# Altium project Power_Embedded_Board.PrjPcb
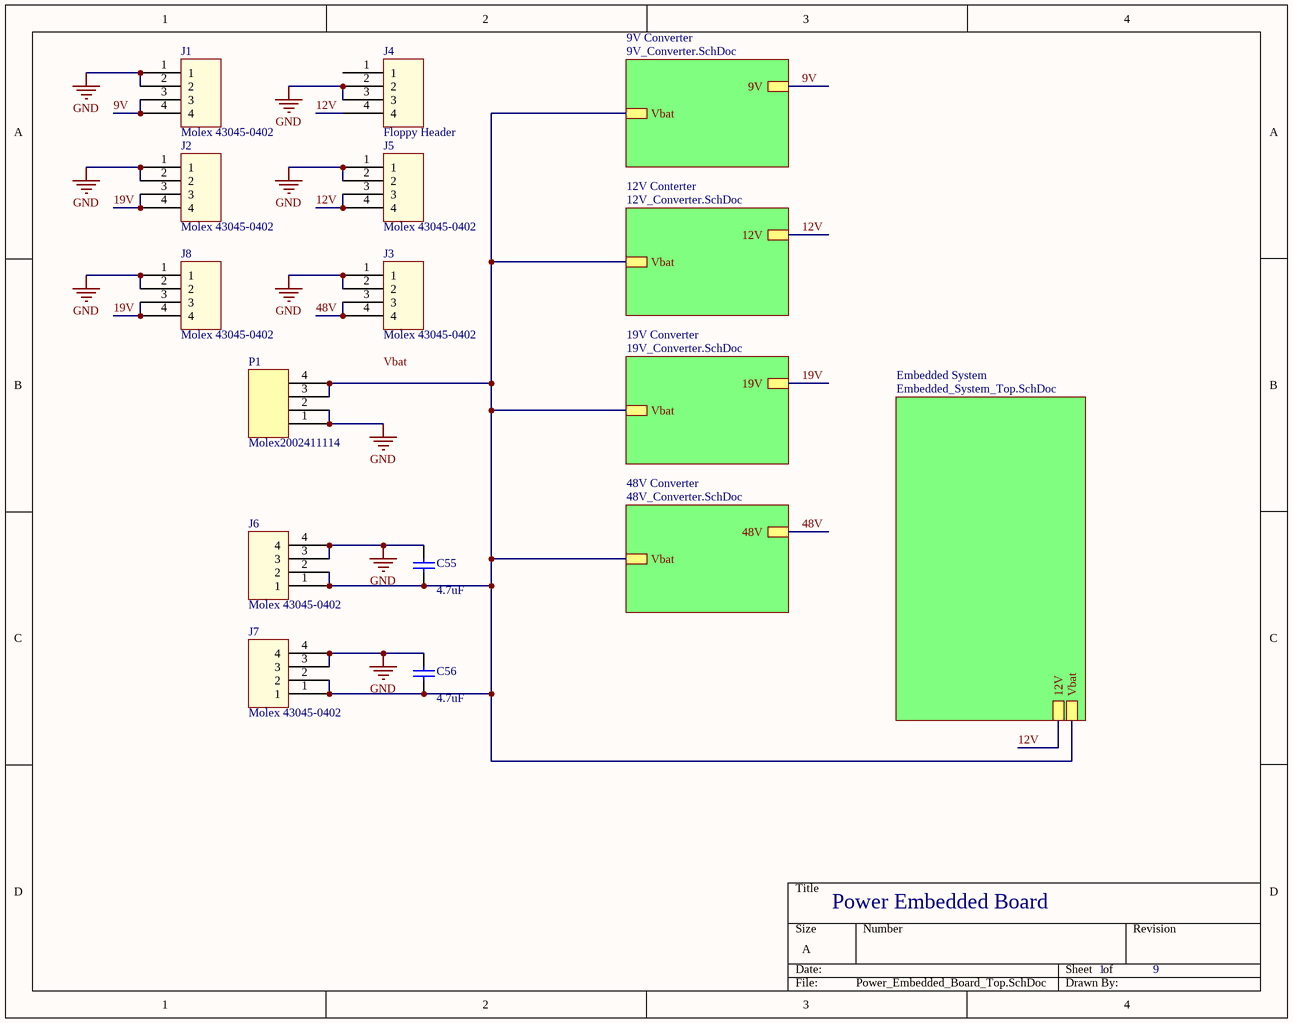
[diagram p0: Power_Embedded_Board_Top.SchDoc]
8 sheets, 160 parts. Net scope: hierarchical (ports join the sheet entries above them; power ports are global).
Board file: Power_Embedded_Board.PcbDoc
Sheets:
  Power_Embedded_Board_Top.SchDoc
    9V Converter = 9V_Converter.SchDoc
    12V Conterter = 12V_Converter.SchDoc
    19V Converter = 19V_Converter.SchDoc
    48V Converter = 48V_Converter.SchDoc
    Embedded System = Embedded_System_Top.SchDoc
      Embedded_Chip = Embedded_Chip.SchDoc
      Embedded Circuits = Embedded_Circuits.SchDoc

## Sheet Power_Embedded_Board_Top.SchDoc
size A; SheetNumber: 1; SheetTotal: 9

### Parts
C55  value 4.7uF  [C1210]  (hidden comment: HMK325C7475KN-TE)
C56  value 4.7uF  [C1210]  (hidden comment: HMK325C7475KN-TE)
J1  Molex 43045-0402  [Molex43045-0402]
J2  Molex 43045-0402  [Molex43045-0402]
J3  Molex 43045-0402  [Molex43045-0402]
J4  Floppy Header  [Header 1x4 12V]
J5  Molex 43045-0402  [Molex43045-0402]
J6  Molex 43045-0402  [Molex43045-0402]
J7  Molex 43045-0402  [Molex43045-0402]
J8  Molex 43045-0402  [Molex43045-0402]
P1  Molex2002411114  [Molex2002411114]

### Sub-sheets
9V Converter = 9V_Converter.SchDoc: Vbat, 9V
12V Conterter = 12V_Converter.SchDoc: Vbat, 12V
19V Converter = 19V_Converter.SchDoc: Vbat, 19V
48V Converter = 48V_Converter.SchDoc: Vbat, 48V
Embedded System = Embedded_System_Top.SchDoc: Vbat, 12V

### Nets
GND: C55.2 C56.2 J1.1 J1.2 J2.1 J2.2 J3.1 J3.2 J4.2 J4.3 J5.1 J5.2 J6.3 J6.4 J7.3 J7.4 J8.1 J8.2 P1.1 P1.2
9V: J1.3 J1.4 ; sheet 9V Converter/9V
12V: J4.4 J5.3 J5.4 ; sheet 12V Conterter/12V, sheet Embedded System/12V
19V: J2.3 J2.4 J8.3 J8.4 ; sheet 19V Converter/19V
48V: J3.3 J3.4 ; sheet 48V Converter/48V
Vbat: C55.1 C56.1 J6.1 J6.2 J7.1 J7.2 P1.3 P1.4 ; sheet 9V Converter/Vbat, sheet 12V Conterter/Vbat, sheet 19V Converter/Vbat, sheet 48V Converter/Vbat, sheet Embedded System/Vbat

Not connected (* = marked no-connect by the designer): J4 1

### Notes on the sheet
- Power Embedded Board
- Labels drawn without touching a wire or pin: Vbat

### Library data of the parts
C55 C56 = Cap Semi: Capacitor (Semiconductor SIM Model); Published: 8-Jun-2000; LatestRevisionDate: 29-May-2009; LatestRevisionNote: IPC-7351 Footprint Added.; PackageReference: C1206; Publisher: Altium Limited; PackageDescription: Chip Capacitor; ComponentLink1Description: Datasheet; ComponentLink1URL: https://www.yuden.co.jp/productdata/catalog/mlcc06_e.pdf; ComponentLink2Description: Digi-Key; ComponentLink2URL: https://www.digikey.com/product-detail/en/taiyo-yuden/HMK325C7475KN-TE/587-5038-1-ND/6563881
J1-J8 = Molex43045-0402: Micro-Fit 3.0 Right Angle Header, 3.00mm Pitch, Dual Row, 4 Circuits, with Snap-in Plastic Peg PCB Lock, Gold, Glow Wire Capable, Black; ComponentLink1Description: Molex Website; ComponentLink1URL: https://www.molex.com/molex/products/datasheet.jsp?part=active/0430450402_PCB_HEADERS.xml

## Sheet 9V_Converter.SchDoc
size A; SheetNumber: 5; SheetTotal: 9
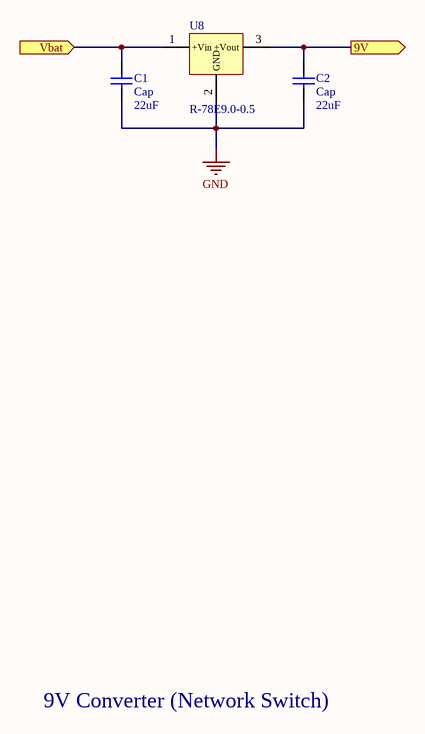
[diagram p1: 9V_Converter.SchDoc]

### Parts
C1  Cap  value 22uF  [C1206]
C2  Cap  value 22uF  [C1206]
U8  R-78E9.0-0.5  [R-78Exx-0.5]

### Ports
9V (out), Vbat (in)

### Nets
GND: C1.1 C2.1 U8.2(GND)
9V: C2.2 U8.3(+Vout) ; port 9V
Vbat: C1.2 U8.1(+Vin) ; port Vbat

### Notes on the sheet
- 9V Converter (Network Switch)

### Library data of the parts
C1 C2 = Cap Semi: Capacitor (Semiconductor SIM Model); Published: 8-Jun-2000; LatestRevisionDate: 29-May-2009; LatestRevisionNote: IPC-7351 Footprint Added.; PackageReference: C1206; Publisher: Altium Limited; PackageDescription: Chip Capacitor
U8 = R-78Exx-0.5: 0.5A DC/DC Voltage Converter; Datasheet: https://www.recom-power.com/pdf/Innoline/R-78Exx-0.5.pdf; Digikey: https://www.digikey.com/product-detail/en/recom-power/R-78E9-0-0-5/945-2638-5-ND/6010095

## Sheet 12V_Converter.SchDoc
size A; SheetNumber: 7; SheetTotal: 9
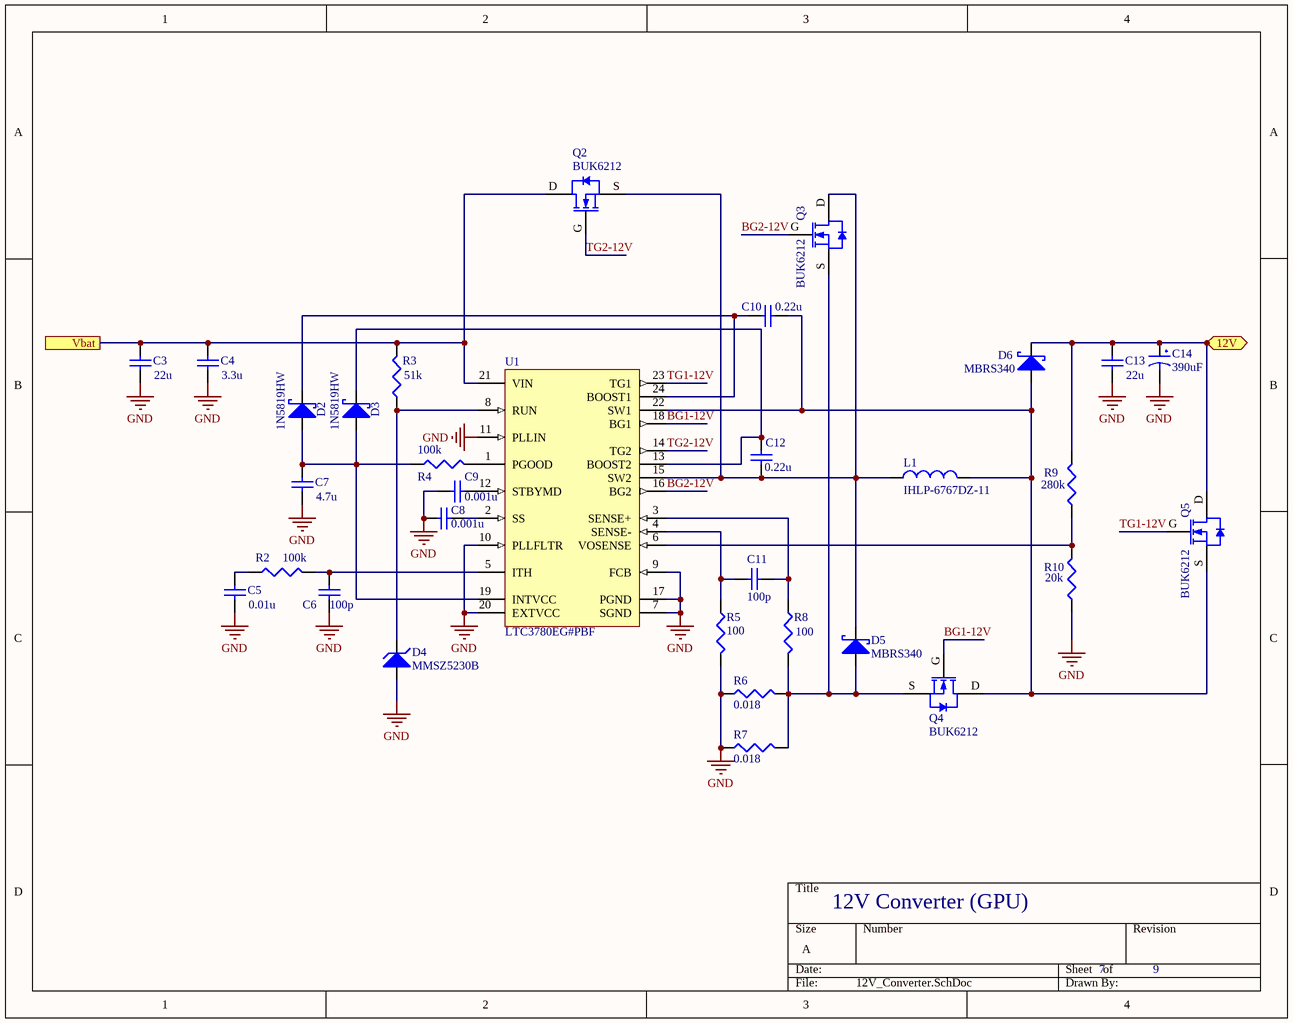
[diagram p2: 12V_Converter.SchDoc]

### Parts
(Parts that share a designator on the sheet are numbered #1, #2 ... from top to bottom, then left to right.)
C3#1  value 22u  [C1206]  (hidden comment: Cap Semi)
C4#1  value 3.3u  [C1206]  (hidden comment: Cap Semi)
C5#1  value 0.01u  [C1206]  (hidden comment: Cap Semi)
C6#1  value 100p  [C1206]  (hidden comment: Cap Semi)
C7#1  value 4.7u  [C1206]  (hidden comment: Cap Semi)
C8#1  value 0.001u  [C1206]  (hidden comment: Cap Semi)
C9#1  value 0.001u  [C1206]  (hidden comment: Cap Semi)
C10#1  value 0.22u  [C1206]  (hidden comment: Cap Semi)
C11#1  value 100p  [C1206]  (hidden comment: Cap Semi)
C12#1  value 0.22u  [C1206]  (hidden comment: Cap Semi)
C13#1  value 22u  [C1206]  (hidden comment: Cap Semi)
C14#1  390uF  [PCVxxxxxMCLxGS]
D2#1  1N5819HW  [1N58xx]
D3  1N5819HW  [1N58xx]
D4  MMSZ5230B  [ONSC-SOD-123-2-425-04_V]
D5  MBRS340  [MBRS340]
D6#1  MBRS340  [MBRS340]
L1#1  IHLP-6767DZ-11  [IHLP-6767DZ-11]
Q2#1  BUK6212  [NXP-SOT428_M]
Q3#1  BUK6212  [NXP-SOT428_M]
Q4  BUK6212  [NXP-SOT428_M]
Q5#1  BUK6212  [NXP-SOT428_M]
R2#1  value 100k  [J1-0603]  (hidden comment: Res3)
R3#1  value 51k  [J1-0603]  (hidden comment: Res3)
R4#1  value 100k  [J1-0603]  (hidden comment: Res3)
R5#1  value 100  [J1-0603]  (hidden comment: Res3)
R6#1  value 0.018  [R1206]  (hidden comment: Res3)
R7#1  value 0.018  [R1206]  (hidden comment: Res3)
R8  value 100  [J1-0603]  (hidden comment: Res3)
R9  value 280k  [J1-0603]  (hidden comment: Res3)
R10  value 20k  [J1-0603]  (hidden comment: Res3)
U1  LTC3780EG#PBF  [LT-G-24_L]

### Ports
12V (bidir), Vbat

### Nets
GND: C3#1.1 C4#1.1 C5#1.1 C6#1.1 C7#1.1 C8#1.1 C9#1.1 C13#1.1 C14#1.2 D4.2(A) R5#1.2 R6#1.1 R7#1.1 R10.1 U1.7(SGND) U1.9(FCB) U1.10(PLLFLTR) U1.11(PLLIN) U1.17(PGND) U1.20(EXTVCC)
12V: C13#1.2 C14#1.1 D6#1.K(Cathode) Q5#1.D R9.2 ; port 12V
BG1-12V: Q4.G U1.18(BG1)
BG2-12V: Q3#1.G U1.16(BG2)
TG1-12V: Q5#1.G U1.23(TG1)
TG2-12V: Q2#1.G U1.14(TG2)
Vbat: C3#1.2 C4#1.2 Q2#1.D R3#1.2 U1.21(VIN) ; port Vbat
NetC5#1_2: C5#1.2 R2#1.1
NetC6#1_2: C6#1.2 R2#1.2 U1.5(ITH)
NetC7#1_2: C7#1.2 D2#1.A(Anode) D3.A(Anode) R4#1.1 U1.19(INTVCC)
NetC8#1_2: C8#1.2 U1.2(SS)
NetC9#1_2: C9#1.2 U1.12(STBYMD)
NetC10#1_1: C10#1.1 D6#1.A(Anode) L1#1.2 Q4.D Q5#1.S U1.22(SW1)
NetC10#1_2: C10#1.2 D2#1.K(Cathode) U1.24(BOOST1)
NetC11#1_1: C11#1.1 R5#1.1 U1.4(SENSE-)
NetC11#1_2: C11#1.2 R8.1 U1.3(SENSE+)
NetC12#1_1: C12#1.1 D5.K(Cathode) L1#1.1 Q2#1.S Q3#1.D U1.15(SW2)
NetC12#1_2: C12#1.2 D3.K(Cathode) U1.13(BOOST2)
NetD4_1: D4.1(K) R3#1.1 U1.8(RUN)
NetD5_A: D5.A(Anode) Q3#1.S Q4.S R6#1.2 R7#1.2 R8.2
NetR4#1_2: R4#1.2 U1.1(PGOOD)
NetR9_1: R9.1 R10.2 U1.6(VOSENSE)

### Notes on the sheet
- 12V Converter (GPU)

### Library data of the parts
C3#1 C4#1 C5#1 C6#1 C7#1 C8#1 C9#1 C10#1 C11#1 C12#1 C13#1 = Cap Semi: Capacitor (Semiconductor SIM Model); Published: 8-Jun-2000; LatestRevisionDate: 29-May-2009; LatestRevisionNote: IPC-7351 Footprint Added.; PackageReference: C1206; Publisher: Altium Limited; PackageDescription: Chip Capacitor
C14#1 = PCV1E391MCL2GS: CAP ALUM POLY 390UF 20% 25V SMD; Digikey: https://www.digikey.com/product-detail/en/nichicon/PCV1E391MCL2GS/493-4544-1-ND/2786841; Datasheet: http://nichicon-us.com/english/products/pdfs/e-pcv.pdf
D2#1 D3 = 1N58xx: 1A Schottky Barrier Rectifier Diode; Datasheet: http://www.kesenes.com/pdf/1n5817-1n5819.pdf
D4 = MMSZ5230BT1G: Zener Voltage Regulator, 500 mW, 2-Pin SOD-123, Pb-Free, Tape and Reel; Manufacturer: On Semiconductor; P Max (W): 0.5; VZ Typ (V): 4.7; DatasheetVersion: Rev. 12; PackageVersion: Rev. G, 10/2009; PackageReference: SOD-123-2-425-04; PackageDescription: 2-Pin SOD, Body 1.6 x 2.69 mm; Supplier 1: Digi-Key; Supplier Part Number 1: MMSZ5230BT1GOSTR-ND; Supplier 2: Digi-Key; Supplier Part Number 2: MMSZ5230BT1GOSCT-ND; Supplier 3: Digi-Key; Supplier Part Number 3: MMSZ5230BT1GOSDKR-ND; Supplier 4: Farnell; Supplier Part Number 4: 1431272; Supplier 5: Farnell; Supplier Part Number 5: 1431272RL; Supplier 6: Farnell; Supplier Part Number 6: 2370826; Supplier 7: Newark; Supplier Part Number 7: 83H7423; Supplier 8: Newark; Supplier Part Number 8: 67R1368; Supplier 9: Mouser; Supplier Part Number 9: 863-MMSZ5230BT1G; Packing: Tape and Reel; RoHS: Pb-Free; Mounting Technology: Surface Mount; PartNumber: MMSZ5230BT1G; ComponentLink1Description: Manufacturer URL; ComponentLink1URL: http://www.onsemi.com/; ComponentLink2Description: Datasheet; ComponentLink2URL: http://www.onsemi.com/pub_link/Collateral/MMSZ5221BT1-D.PDF; ComponentLink3Description: Package Specification; ComponentLink3URL: http://www.onsemi.com/pub_link/Collateral/425-04.PDF
D5 D6#1 = MBRS340: Schottky Rectifier; Datasheet: https://www.mouser.com/ds/2/308/MBRS340-1120985.pdf
L1#1 = IHLP-6767DZ-11: 15µH Shielded Molded Inductor 14A 14.4 mOhm Max Nonstandard; Datasheet: http://www.vishay.com/docs/34306/lp67dz11.pdf; Digikey: https://www.digikey.com/product-detail/en/vishay-dale/IHLP6767GZER150M11/541-1287-1-ND/2139413
Q2#1 Q3#1 Q4 Q5#1 = BUK6212: N-Channel TrenchMOS Intermediate Level FET, 40 V, 50 A, 3-Pin SOT428, Tape and Reel; Manufacturer: NXP Semiconductors; PartNumber: BUK6212-40C,118; Automotive Qualified: Y; Channel Type: N; ID [max] (A): 50; IDM [max] (A): 233; Packing: Tape & Reel; Qr [typ] (nC): 38; VDS [max] (V): 40; VGSth [typ] (V): 2.3; DatasheetVersion: Rev. 2; PackageVersion: 14-06-10, 06/2014; PackageReference: SOT428; PackageDescription: 3-Pin Plastic Single-ended Surface Mounted Package, Body 6.1 x 6.6 mm, Pitch 2.285 mm; Supplier 1: Digi-Key; Supplier Part Number 1: 568-6983-2-ND; Supplier 2: Digi-Key; Supplier Part Number 2: 568-6983-1-ND; Supplier 3: Digi-Key; Supplier Part Number 3: 568-6983-6-ND; Supplier 4: Mouser; Supplier Part Number 4: 771-BUK621240C118; Mounting Technology: Surface Mount; Code_JEITA: SC-63; Code_JEDEC: TO-252; ComponentLink1Description: Manufacturer URL; ComponentLink1URL: http://www.nxp.com/; ComponentLink2Description: Datasheet; ComponentLink2URL: http://www.nxp.com/documents/data_sheet/BUK6212-40C.pdf; ComponentLink3Description: Package Specification; ComponentLink3URL: http://www.nxp.com/documents/outline_drawing/sot428_po.pdf
R2#1 R3#1 R4#1 R5#1 R6#1 R7#1 R8-R10 = Res3: Resistor; Published: 8-Jun-2000; LatestRevisionDate: 29-May-2009; LatestRevisionNote: IPC-7351 Footprint Added.; PackageReference: J1-0603; Publisher: Altium Limited; PackageDescription: Chip Resistor
U1 = LTC3780EG#PBF: Buck-boost Controller, Constant Frequency, Current Mode Control with Power Good Output, 24-pin SOP (G-24), -40 to 85 degC, Pb-Free; Manufacturer: Linear Technology; Frequency Sync Range: 200kHz - 400kHz; Number of Outputs: 1; DatasheetVersion: Rev. F; PackageVersion: Jun-10; PackageReference: G-24; PackageDescription: 24-Pin Plastic SSOP, Body 8.2 x 5.3 mm, Pitch 0.65 mm; Supplier 1: Digi-Key; Supplier Part Number 1: LTC3780EG#PBF-ND; Supplier 2: Farnell; Supplier Part Number 2: 1273545; Supplier 3: Newark; Supplier Part Number 3: 56M8395; RoHS: TRUE; Mounting Technology: Surface Mount; PartNumber: LTC3780EG#PBF; ComponentLink1Description: Manufacturer URL; ComponentLink1URL: http://www.linear.com/; ComponentLink2Description: Datasheet; ComponentLink2URL: http://cds.linear.com/docs/en/datasheet/3780ff.pdf; ComponentLink3Description: Package Specification; ComponentLink3URL: http://cds.linear.com/docs/en/packaging/SSOP_24_05-08-1640.pdf

## Sheet 19V_Converter.SchDoc
size A; SheetNumber: 7; SheetTotal: 9
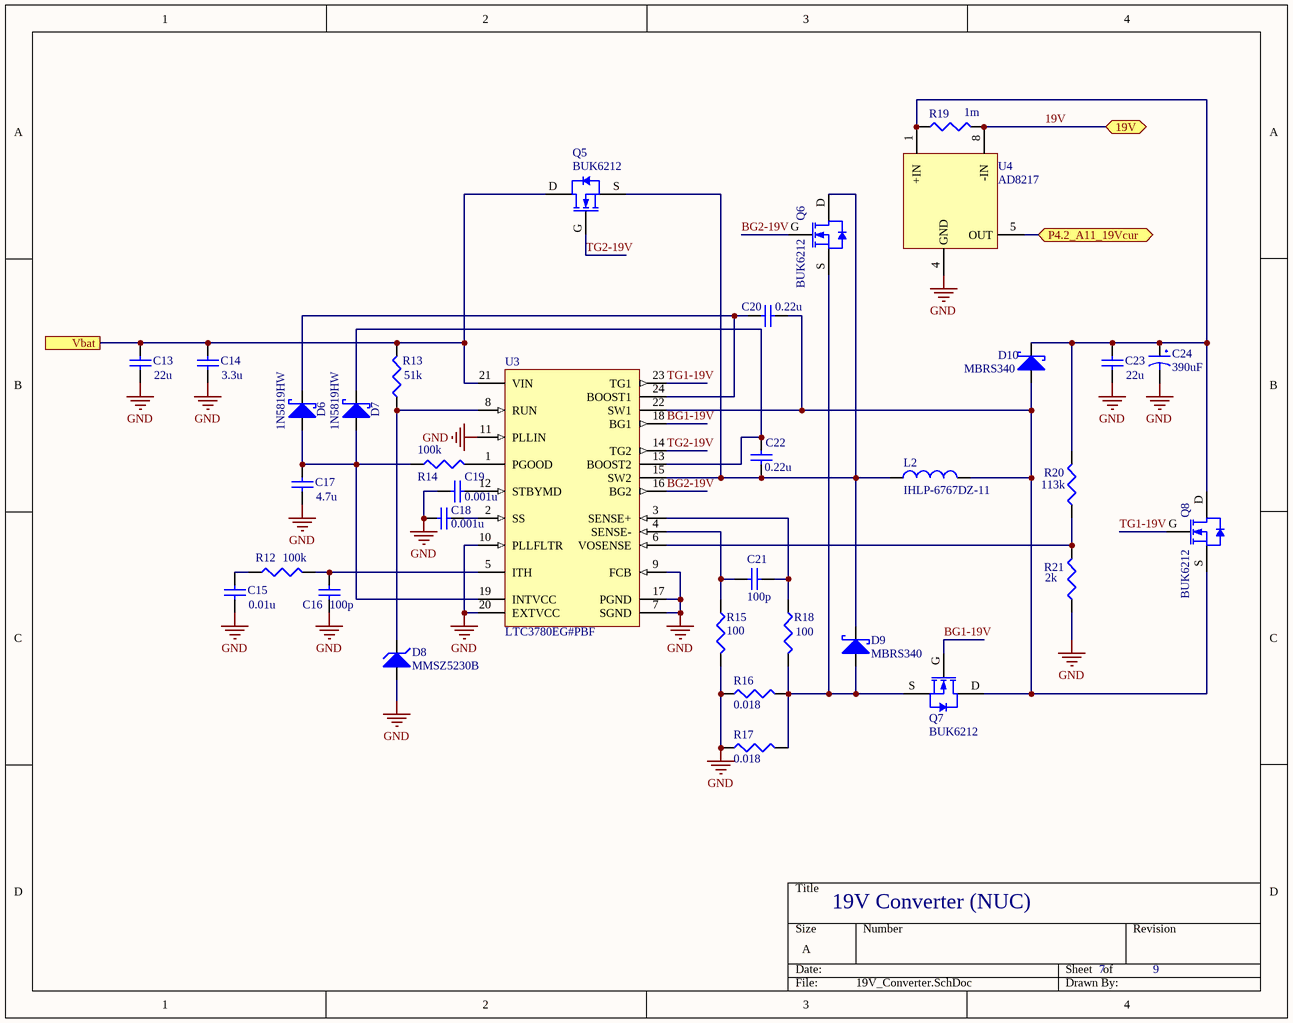
[diagram p3: 19V_Converter.SchDoc]

### Parts
(Parts that share a designator on the sheet are numbered #1, #2 ... from top to bottom, then left to right.)
C13#2  value 22u  [C1206]  (hidden comment: Cap Semi)
C14#2  value 3.3u  [C1206]  (hidden comment: Cap Semi)
C15  value 0.01u  [C1206]  (hidden comment: Cap Semi)
C16  value 100p  [C1206]  (hidden comment: Cap Semi)
C17  value 4.7u  [C1206]  (hidden comment: Cap Semi)
C18  value 0.001u  [C1206]  (hidden comment: Cap Semi)
C19  value 0.001u  [C1206]  (hidden comment: Cap Semi)
C20  value 0.22u  [C1206]  (hidden comment: Cap Semi)
C21  value 100p  [C1206]  (hidden comment: Cap Semi)
C22  value 0.22u  [C1206]  (hidden comment: Cap Semi)
C23  value 22u  [C1206]  (hidden comment: Cap Semi)
C24  390uF  [PCVxxxxxMCLxGS]
D6#2  1N5819HW  [1N58xx]
D7  1N5819HW  [1N58xx]
D8  MMSZ5230B  [ONSC-SOD-123-2-425-04_V]
D9  MBRS340  [MBRS340]
D10  MBRS340  [MBRS340]
L2  IHLP-6767DZ-11  [IHLP-6767DZ-11]
Q5#2  BUK6212  [NXP-SOT428_M]
Q6  BUK6212  [NXP-SOT428_M]
Q7  BUK6212  [NXP-SOT428_M]
Q8  BUK6212  [NXP-SOT428_M]
R12  value 100k  [J1-0603]  (hidden comment: Res3)
R13  value 51k  [J1-0603]  (hidden comment: Res3)
R14  value 100k  [J1-0603]  (hidden comment: Res3)
R15  value 100  [J1-0603]  (hidden comment: Res3)
R16  value 0.018  [R1206]  (hidden comment: Res3)
R17  value 0.018  [R1206]  (hidden comment: Res3)
R18#1  value 100  [J1-0603]  (hidden comment: Res3)
R19  value 1m  [14-1210]  (hidden comment: Res3)
R20  value 113k  [J1-0603]  (hidden comment: Res3)
R21  value 2k  [J1-0603]  (hidden comment: Res3)
U3  LTC3780EG#PBF  [LT-G-24_L]
U4#1  AD8217  [AD8217]

### Ports
19V (bidir), P4.2_A11_19Vcur (bidir), Vbat

### Nets
GND: C13#2.1 C14#2.1 C15.1 C16.1 C17.1 C18.1 C19.1 C23.1 C24.2 D8.2(A) R15.2 R16.1 R17.1 R21.1 U3.7(SGND) U3.9(FCB) U3.10(PLLFLTR) U3.11(PLLIN) U3.17(PGND) U3.20(EXTVCC) U4#1.4(GND)
19V: R19.2 U4#1.8(-IN) ; port 19V
BG1-19V: Q7.G U3.18(BG1)
BG2-19V: Q6.G U3.16(BG2)
TG1-19V: Q8.G U3.23(TG1)
TG2-19V: Q5#2.G U3.14(TG2)
Vbat: C13#2.2 C14#2.2 Q5#2.D R13.2 U3.21(VIN) ; port Vbat
NetC15_2: C15.2 R12.1
NetC16_2: C16.2 R12.2 U3.5(ITH)
NetC17_2: C17.2 D6#2.A(Anode) D7.A(Anode) R14.1 U3.19(INTVCC)
NetC18_2: C18.2 U3.2(SS)
NetC19_2: C19.2 U3.12(STBYMD)
NetC20_1: C20.1 D10.A(Anode) L2.2 Q7.D Q8.S U3.22(SW1)
NetC20_2: C20.2 D6#2.K(Cathode) U3.24(BOOST1)
NetC21_1: C21.1 R15.1 U3.4(SENSE-)
NetC21_2: C21.2 R18#1.1 U3.3(SENSE+)
NetC22_1: C22.1 D9.K(Cathode) L2.1 Q5#2.S Q6.D U3.15(SW2)
NetC22_2: C22.2 D7.K(Cathode) U3.13(BOOST2)
NetC23_2: C23.2 C24.1 D10.K(Cathode) Q8.D R19.1 R20.2 U4#1.1(+IN)
NetD8_1: D8.1(K) R13.1 U3.8(RUN)
NetD9_A: D9.A(Anode) Q6.S Q7.S R16.2 R17.2 R18#1.2
NetR14_2: R14.2 U3.1(PGOOD)
NetR20_1: R20.1 R21.2 U3.6(VOSENSE)
NetU4#1_5: U4#1.5(OUT) ; port P4.2_A11_19Vcur

### Notes on the sheet
- 19V Converter (NUC)

### Library data of the parts
C13#2 C14#2 C15-C23 = Cap Semi: Capacitor (Semiconductor SIM Model); Published: 8-Jun-2000; LatestRevisionDate: 29-May-2009; LatestRevisionNote: IPC-7351 Footprint Added.; PackageReference: C1206; Publisher: Altium Limited; PackageDescription: Chip Capacitor
C24 = PCV1E391MCL2GS: CAP ALUM POLY 390UF 20% 25V SMD; Digikey: https://www.digikey.com/product-detail/en/nichicon/PCV1E391MCL2GS/493-4544-1-ND/2786841; Datasheet: http://nichicon-us.com/english/products/pdfs/e-pcv.pdf
D6#2 D7 = 1N58xx: 1A Schottky Barrier Rectifier Diode; Datasheet: http://www.kesenes.com/pdf/1n5817-1n5819.pdf
D8 = MMSZ5230BT1G: as D4 on sheet 12V_Converter; DatasheetVersion: Rev. 12; PackageVersion: Rev. G, 10/2009; PackageReference: SOD-123-2-425-04; PackageDescription: 2-Pin SOD, Body 1.6 x 2.69 mm; Supplier 1: Digi-Key; Supplier Part Number 1: MMSZ5230BT1GOSTR-ND; Supplier 2: Digi-Key; Supplier Part Number 2: MMSZ5230BT1GOSCT-ND; Supplier 3: Digi-Key; Supplier Part Number 3: MMSZ5230BT1GOSDKR-ND; Supplier 4: Farnell; Supplier Part Number 4: 1431272; Supplier 5: Farnell; Supplier Part Number 5: 1431272RL; Supplier 6: Farnell; Supplier Part Number 6: 2370826; Supplier 7: Newark; Supplier Part Number 7: 83H7423; Supplier 8: Newark; Supplier Part Number 8: 67R1368; Supplier 9: Mouser; Supplier Part Number 9: 863-MMSZ5230BT1G; Packing: Tape and Reel; RoHS: Pb-Free; Mounting Technology: Surface Mount; PartNumber: MMSZ5230BT1G; ComponentLink1Description: Manufacturer URL; ComponentLink1URL: http://www.onsemi.com/; ComponentLink2Description: Datasheet; ComponentLink2URL: http://www.onsemi.com/pub_link/Collateral/MMSZ5221BT1-D.PDF; ComponentLink3Description: Package Specification; ComponentLink3URL: http://www.onsemi.com/pub_link/Collateral/425-04.PDF
D9 D10 = MBRS340: Schottky Rectifier; Datasheet: https://www.mouser.com/ds/2/308/MBRS340-1120985.pdf
L2 = IHLP-6767DZ-11: as L1#1 on sheet 12V_Converter; Datasheet: http://www.vishay.com/docs/34306/lp67dz11.pdf; Digikey: https://www.digikey.com/product-detail/en/vishay-dale/IHLP6767GZER150M11/541-1287-1-ND/2139413
Q5#2 Q6-Q8 = BUK6212: as Q2#1 on sheet 12V_Converter; DatasheetVersion: Rev. 2; PackageVersion: 14-06-10, 06/2014; PackageReference: SOT428; PackageDescription: 3-Pin Plastic Single-ended Surface Mounted Package, Body 6.1 x 6.6 mm, Pitch 2.285 mm; Supplier 1: Digi-Key; Supplier Part Number 1: 568-6983-2-ND; Supplier 2: Digi-Key; Supplier Part Number 2: 568-6983-1-ND; Supplier 3: Digi-Key; Supplier Part Number 3: 568-6983-6-ND; Supplier 4: Mouser; Supplier Part Number 4: 771-BUK621240C118; Mounting Technology: Surface Mount; Code_JEITA: SC-63; Code_JEDEC: TO-252; ComponentLink1Description: Manufacturer URL; ComponentLink1URL: http://www.nxp.com/; ComponentLink2Description: Datasheet; ComponentLink2URL: http://www.nxp.com/documents/data_sheet/BUK6212-40C.pdf; ComponentLink3Description: Package Specification; ComponentLink3URL: http://www.nxp.com/documents/outline_drawing/sot428_po.pdf
R12-R17 R18#1 R19-R21 = Res3: Resistor; Published: 8-Jun-2000; LatestRevisionDate: 29-May-2009; LatestRevisionNote: IPC-7351 Footprint Added.; PackageReference: J1-0603; Publisher: Altium Limited; PackageDescription: Chip Resistor
U3 = LTC3780EG#PBF: as U1 on sheet 12V_Converter; DatasheetVersion: Rev. F; PackageVersion: Jun-10; PackageReference: G-24; PackageDescription: 24-Pin Plastic SSOP, Body 8.2 x 5.3 mm, Pitch 0.65 mm; Supplier 1: Digi-Key; Supplier Part Number 1: LTC3780EG#PBF-ND; Supplier 2: Farnell; Supplier Part Number 2: 1273545; Supplier 3: Newark; Supplier Part Number 3: 56M8395; RoHS: TRUE; Mounting Technology: Surface Mount; PartNumber: LTC3780EG#PBF; ComponentLink1Description: Manufacturer URL; ComponentLink1URL: http://www.linear.com/; ComponentLink2Description: Datasheet; ComponentLink2URL: http://cds.linear.com/docs/en/datasheet/3780ff.pdf; ComponentLink3Description: Package Specification; ComponentLink3URL: http://cds.linear.com/docs/en/packaging/SSOP_24_05-08-1640.pdf
U4#1 = AD8217: High Resolution, Zero-Drift  Current Shunt Monitor; Datasheet: https://www.analog.com/media/en/technical-documentation/data-sheets/AD8217.pdf

## Sheet 48V_Converter.SchDoc
size A; SheetNumber: 8; SheetTotal: 9
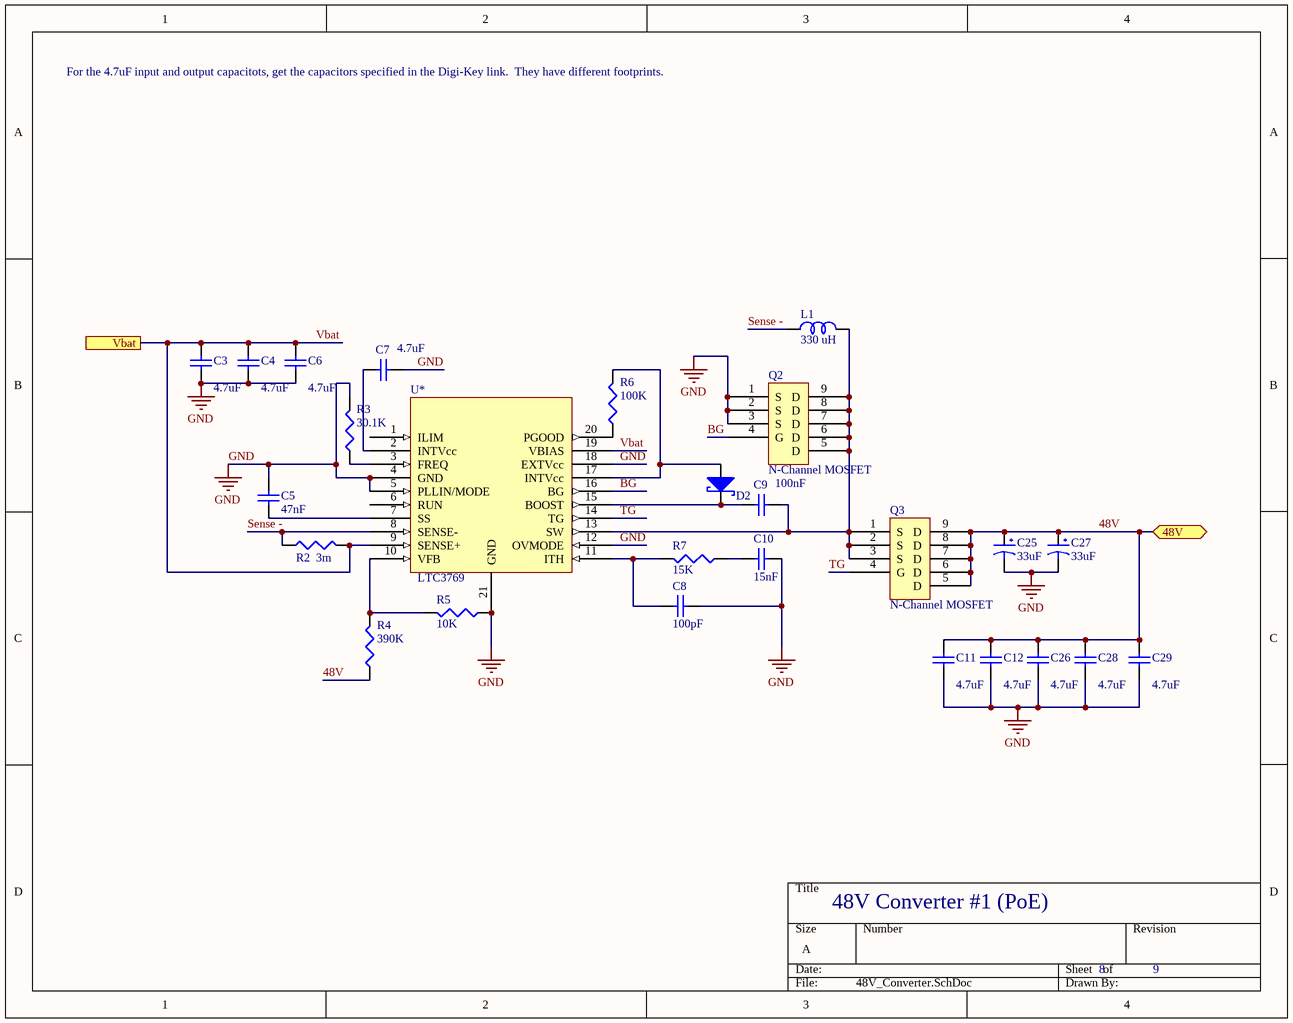
[diagram p4: 48V_Converter.SchDoc]

### Parts
(Parts that share a designator on the sheet are numbered #1, #2 ... from top to bottom, then left to right.)
C3#2  value 4.7uF  [C1210]  (hidden comment: HMK325C7475KN-TE)
C4#2  value 4.7uF  [C1210]  (hidden comment: HMK325C7475KN-TE)
C5#2  value 47nF  [C1206]  (hidden comment: Cap Semi)
C6#2  value 4.7uF  [C1210]  (hidden comment: HMK325C7475KN-TE)
C7#2  value 4.7uF  [C1206]  (hidden comment: Cap Semi)
C8#2  value 100pF  [C1206]  (hidden comment: Cap Semi)
C9#2  value 100nF  [C1206]  (hidden comment: Cap Semi)
C10#2  value 15nF  [C1206]  (hidden comment: Cap Semi)
C11#2  value 4.7uF  [C1210]  (hidden comment: HMK325C7475KN-TE)
C12#2  value 4.7uF  [C1210]  (hidden comment: HMK325C7475KN-TE)
C25  33uF  [UUX1J330MNL6GS]
C26  value 4.7uF  [C1210]  (hidden comment: HMK325C7475KN-TE)
C27  33uF  [UUX1J330MNL6GS]
C28  value 4.7uF  [C1210]  (hidden comment: HMK325C7475KN-TE)
C29  value 4.7uF  [C1210]  (hidden comment: HMK325C7475KN-TE)
D2#2  SCHOTTKY  [BAS170W]  (value not drawn)
L1#2  330 uH  [PQ2617BHA-330K]
Q2#2  N-Channel MOSFET  [BSC028N06LS3]
Q3#2  N-Channel MOSFET  [BSC028N06LS3]
R2#2  value 3m  [J1-0603]  (hidden comment: Res3)
R3#2  value 30.1K  [J1-0603]  (hidden comment: Res3)
R4#2  value 390K  [J1-0603]  (hidden comment: Res3)
R5#2  value 10K  [J1-0603]  (hidden comment: Res3)
R6#2  value 100K  [J1-0603]  (hidden comment: Res3)
R7#2  value 15K  [J1-0603]  (hidden comment: Res3)
U*  LTC3769  [LTC3769]

### Ports
48V (bidir), Vbat

### Nets
GND: C3#2.1 C4#2.1 C5#2.2 C6#2.1 C7#2.1 C8#2.1 C10#2.1 C11#2.1 C12#2.1 C25.2 C26.1 C27.2 C28.1 C29.1 Q2#2.1(S) Q2#2.2(S) Q2#2.3(S) R3#2.2 R5#2.1 U*.4(GND) U*.5(PLLIN/MODE) U*.12(OVMODE) U*.18(EXTVcc) U*.21(GND)
48V: C11#2.2 C12#2.2 C25.1 C26.2 C27.1 C28.2 C29.2 Q3#2.5(D) Q3#2.6(D) Q3#2.7(D) Q3#2.8(D) Q3#2.9(D) R4#2.1 ; port 48V
BG: Q2#2.4(G) U*.16(BG)
Sense -: L1#2.2 R2#2.1 U*.8(SENSE-)
TG: Q3#2.4(G) U*.14(TG)
Vbat: C3#2.2 C4#2.2 C6#2.2 R2#2.2 U*.9(SENSE+) U*.19(VBIAS) ; port Vbat
NetC5#2_1: C5#2.1 U*.7(SS)
NetC7#2_2: C7#2.2 U*.2(INTVcc)
NetC8#2_2: C8#2.2 R7#2.2 U*.11(ITH)
NetC9#2_1: C9#2.1 L1#2.1 Q2#2.5(D) Q2#2.6(D) Q2#2.7(D) Q2#2.8(D) Q2#2.9(D) Q3#2.1(S) Q3#2.2(S) Q3#2.3(S) U*.13(SW)
NetC9#2_2: C9#2.2 D2#2.K(Cathode) U*.15(BOOST)
NetC10#2_2: C10#2.2 R7#2.1
NetD2#2_A: D2#2.A(Anode) R6#2.2 U*.17(INTVcc)
NetR3#2_1: R3#2.1 U*.3(FREQ)
NetR4#2_2: R4#2.2 R5#2.2 U*.10(VFB)
NetR6#2_1: R6#2.1 U*.20(PGOOD)

Not connected (* = marked no-connect by the designer): U* 1(ILIM) 6(RUN)

### Notes on the sheet
- For the 4.7uF input and output capacitots, get the capacitors specified in the Digi-Key link.  They have different footprints.
- 48V Converter #1 (PoE)

### Library data of the parts
C3#2 C4#2 C5#2 C6#2 C7#2 C8#2 C9#2 C10#2 C11#2 C12#2 C26 C28 C29 = Cap Semi: Capacitor (Semiconductor SIM Model); Published: 8-Jun-2000; LatestRevisionDate: 29-May-2009; LatestRevisionNote: IPC-7351 Footprint Added.; PackageReference: C1206; Publisher: Altium Limited; PackageDescription: Chip Capacitor
  C3#2 C4#2 C6#2 C11#2 C12#2 C26 C28 C29: ComponentLink1Description: Datasheet; ComponentLink1URL: https://www.yuden.co.jp/productdata/catalog/mlcc06_e.pdf; ComponentLink2Description: Digi-Key; ComponentLink2URL: https://www.digikey.com/product-detail/en/taiyo-yuden/HMK325C7475KN-TE/587-5038-1-ND/6563881
C25 C27 = UUX1J330MNL6GS: CAP ALUM 33UF 20% 63V SMD; Digikey: https://www.digikey.com/product-detail/en/nichicon/UWX1C100MCL2GB/493-2099-1-ND/590074; Datasheet: http://nichicon-us.com/english/products/pdfs/e-uwx.pdf; ComponentLink1Description: Digi-Key; ComponentLink1URL: https://www.digikey.com/product-detail/en/nichicon/UUX1J330MNL6GS/493-9972-1-ND/3974043; ComponentLink2Description: Datasheet; ComponentLink2URL: https://www.nichicon.co.jp/english/products/pdfs/e-uux.pdf
D2#2 = BAS170W: DIODE SCHOTTKY 70V 70MA SOD323-2; ComponentLink1Description: Digi-Key; ComponentLink1URL: https://www.digikey.com/product-detail/en/infineon-technologies/BAS170WE6327HTSA1/BAS170WE6327HTSA1CT-ND/3819495; ComponentLink2Description: Datasheet; ComponentLink2URL: https://www.infineon.com/dgdl/Infineon-BAS70series-DataSheet-v01_00-EN.pdf?fileId=5546d4626d66c2b1016d73f7ecf220d6&redirId=117942
L1#2 = PQ2617BHA-330K: 33µH Shielded Wirewound Inductor 28A 2.5mOhm Max Nonstandard; ComponentLink1Description: Datasheet; ComponentLink1URL: https://www.bourns.com/docs/Product-Datasheets/PQ2617.pdf; ComponentLink2Description: Digi-Key; ComponentLink2URL: https://www.digikey.com/product-detail/en/bourns-inc/PQ2617BHA-330K/PQ2617BHA-330K-ND/7695918
Q2#2 Q3#2 = BSC028N06LS3: ComponentLink1Description: Datasheet; ComponentLink1URL: https://www.mouser.com/datasheet/2/196/Infineon-BSC028N06LS3-DS-v02_02-en-1226498.pdf
R2#2 R3#2 R4#2 R5#2 R6#2 R7#2 = Res3: Resistor; Published: 8-Jun-2000; LatestRevisionDate: 29-May-2009; LatestRevisionNote: IPC-7351 Footprint Added.; PackageReference: J1-0603; Publisher: Altium Limited; PackageDescription: Chip Resistor
U* = LTC3769: 48V Switching converter; ComponentLink1Description: Analog Devices; ComponentLink1URL: https://www.analog.com/en/products/ltc3769.html#; ComponentLink2Description: Datasheet; ComponentLink2URL: https://www.analog.com/media/en/technical-documentation/data-sheets/3769fa.pdf

## Sheet Embedded_System_Top.SchDoc
size A; SheetNumber: 2; SheetTotal: 9
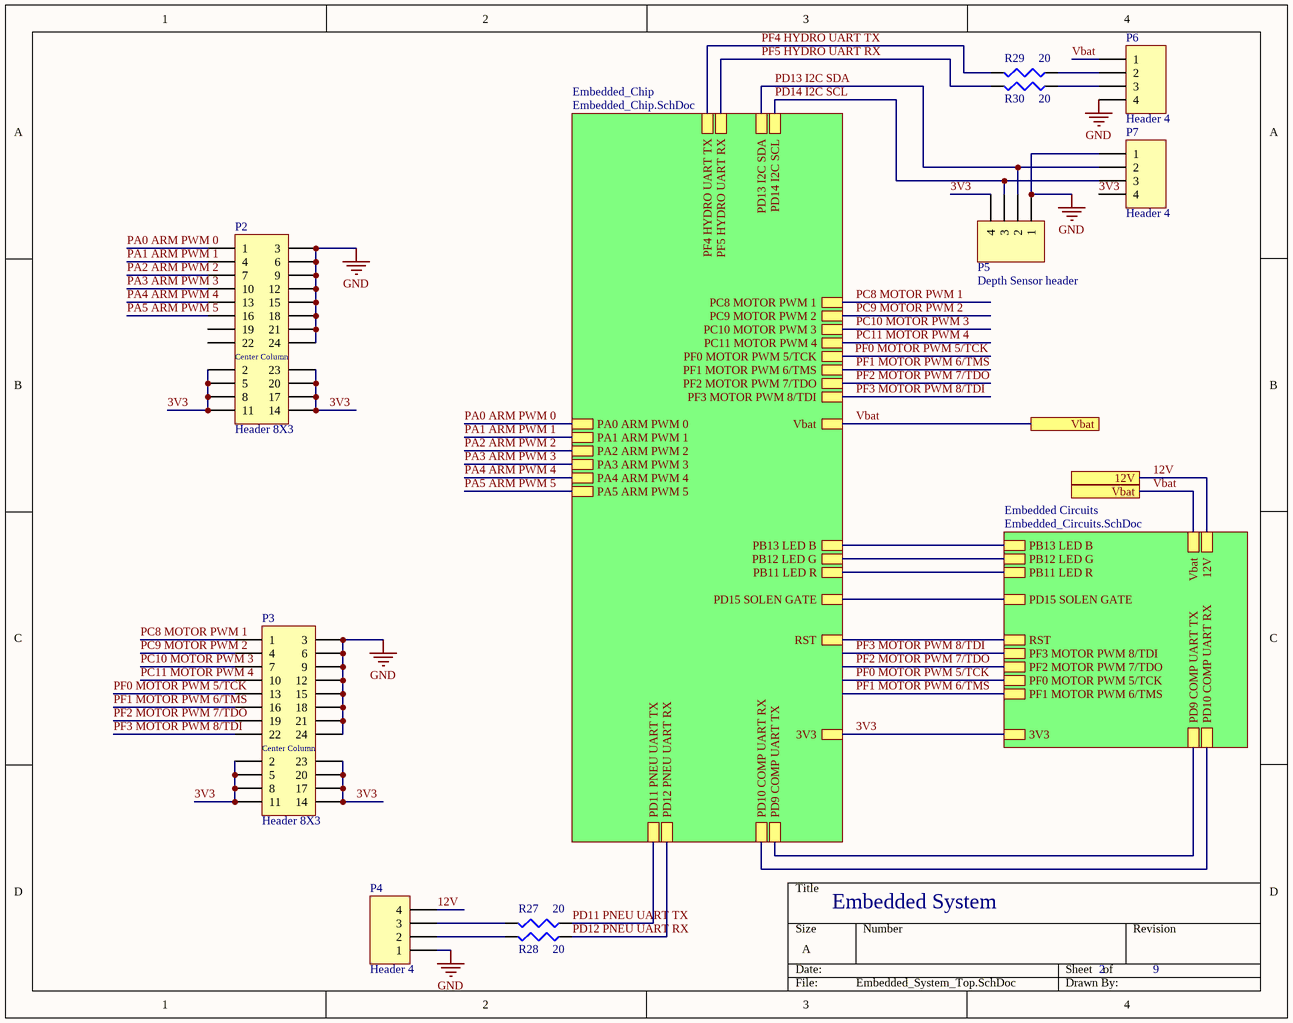
[diagram p5: Embedded_System_Top.SchDoc]

### Parts
P2  Header 8X3  [Header 8X3]
P3  Header 8X3  [Header 8X3]
P4  Header 4  [Header 1x4]
P5  Depth Sensor header  [DF13-4P-1.25DSA]
P6  Header 4  [Header 1x4]
P7  Header 4  [DF13-4P-1.25DSA]
R27  value 20  [J1-0603]  (hidden comment: Res3)
R28  value 20  [J1-0603]  (hidden comment: Res3)
R29  value 20  [J1-0603]  (hidden comment: Res3)
R30  value 20  [J1-0603]  (hidden comment: Res3)

### Sub-sheets
Embedded Circuits = Embedded_Circuits.SchDoc: 3V3, RST, PB11 LED R, PB12 LED G, PB13 LED B, PF3 MOTOR PWM 8/TDI, PF2 MOTOR PWM 7/TDO, PF0 MOTOR PWM 5/TCK, PF1 MOTOR PWM 6/TMS, PD10 COMP UART RX, PD9 COMP UART TX, Vbat, 12V, PD15 SOLEN GATE
Embedded_Chip = Embedded_Chip.SchDoc: 3V3, RST, PB11 LED R, PB13 LED B, PB12 LED G, PD10 COMP UART RX, PD9 COMP UART TX, Vbat, PF3 MOTOR PWM 8/TDI, PF2 MOTOR PWM 7/TDO, PF1 MOTOR PWM 6/TMS, PF0 MOTOR PWM 5/TCK, PC11 MOTOR PWM 4, PC10 MOTOR PWM 3, PC9 MOTOR PWM 2, PC8 MOTOR PWM 1, PF5 HYDRO UART RX, PF4 HYDRO UART TX, PD11 PNEU UART TX, PD12 PNEU UART RX, PA3 ARM PWM 3, PA1 ARM PWM 1, PA2 ARM PWM 2, PA0 ARM PWM 0, PA4 ARM PWM 4, PA5 ARM PWM 5, PD13 I2C SDA, PD14 I2C SCL, PD15 SOLEN GATE

### Ports
12V, Vbat

### Nets
GND: P2.3 P2.6 P2.9 P2.12 P2.15 P2.18 P2.21 P2.24 P3.3 P3.6 P3.9 P3.12 P3.15 P3.18 P3.21 P3.24 P4.1 P5.1 P6.4 P7.1
3V3: P2.2 P2.5 P2.8 P2.11 P2.14 P2.17 P2.20 P2.23 P3.2 P3.5 P3.8 P3.11 P3.14 P3.17 P3.20 P3.23 P5.4 P7.4 ; sheet Embedded_Chip/3V3, sheet Embedded Circuits/3V3
12V: P4.4 ; port 12V, sheet Embedded Circuits/12V
PA0 ARM PWM 0: P2.1 ; sheet Embedded_Chip/PA0 ARM PWM 0
PA1 ARM PWM 1: P2.4 ; sheet Embedded_Chip/PA1 ARM PWM 1
PA2 ARM PWM 2: P2.7 ; sheet Embedded_Chip/PA2 ARM PWM 2
PA3 ARM PWM 3: P2.10 ; sheet Embedded_Chip/PA3 ARM PWM 3
PA4 ARM PWM 4: P2.13 ; sheet Embedded_Chip/PA4 ARM PWM 4
PA5 ARM PWM 5: P2.16 ; sheet Embedded_Chip/PA5 ARM PWM 5
PB11 LED R: sheet Embedded_Chip/PB11 LED R, sheet Embedded Circuits/PB11 LED R
PB12 LED G: sheet Embedded_Chip/PB12 LED G, sheet Embedded Circuits/PB12 LED G
PB13 LED B: sheet Embedded_Chip/PB13 LED B, sheet Embedded Circuits/PB13 LED B
PC8 MOTOR PWM 1: P3.1 ; sheet Embedded_Chip/PC8 MOTOR PWM 1
PC9 MOTOR PWM 2: P3.4 ; sheet Embedded_Chip/PC9 MOTOR PWM 2
PC10 MOTOR PWM 3: P3.7 ; sheet Embedded_Chip/PC10 MOTOR PWM 3
PC11 MOTOR PWM 4: P3.10 ; sheet Embedded_Chip/PC11 MOTOR PWM 4
PD11 PNEU UART TX: R27.1 ; sheet Embedded_Chip/PD11 PNEU UART TX
PD12 PNEU UART RX: R28.1 ; sheet Embedded_Chip/PD12 PNEU UART RX
PD13 I2C SDA: P5.2 P7.2 ; sheet Embedded_Chip/PD13 I2C SDA
PD14 I2C SCL: P5.3 P7.3 ; sheet Embedded_Chip/PD14 I2C SCL
PF0 MOTOR PWM 5/TCK: P3.13 ; sheet Embedded_Chip/PF0 MOTOR PWM 5/TCK, sheet Embedded Circuits/PF0 MOTOR PWM 5/TCK
PF1 MOTOR PWM 6/TMS: P3.16 ; sheet Embedded_Chip/PF1 MOTOR PWM 6/TMS, sheet Embedded Circuits/PF1 MOTOR PWM 6/TMS
PF2 MOTOR PWM 7/TDO: P3.19 ; sheet Embedded_Chip/PF2 MOTOR PWM 7/TDO, sheet Embedded Circuits/PF2 MOTOR PWM 7/TDO
PF3 MOTOR PWM 8/TDI: P3.22 ; sheet Embedded_Chip/PF3 MOTOR PWM 8/TDI, sheet Embedded Circuits/PF3 MOTOR PWM 8/TDI
PF4 HYDRO UART TX: R29.2 ; sheet Embedded_Chip/PF4 HYDRO UART TX
PF5 HYDRO UART RX: R30.2 ; sheet Embedded_Chip/PF5 HYDRO UART RX
RST: sheet Embedded_Chip/RST, sheet Embedded Circuits/RST
Vbat: P6.1 ; port Vbat, sheet Embedded_Chip/Vbat, sheet Embedded Circuits/Vbat
NetP4_2: P4.2 R28.2
NetP4_3: P4.3 R27.2
NetP6_2: P6.2 R29.1
NetP6_3: P6.3 R30.1
NetR38_1: sheet Embedded_Chip/PD15 SOLEN GATE, sheet Embedded Circuits/PD15 SOLEN GATE
NetU4#2_18: sheet Embedded_Chip/PD9 COMP UART TX, sheet Embedded Circuits/PD9 COMP UART TX
NetU4#2_19: sheet Embedded_Chip/PD10 COMP UART RX, sheet Embedded Circuits/PD10 COMP UART RX

Not connected (* = marked no-connect by the designer): P2 19 22

### Notes on the sheet
- Embedded System
- (in symbol Header 8X3 (2mm)) Center Column

### Library data of the parts
P2 P3 = Header 8X3 (2mm): Connector Header Through Hole 24 position 0.079" (2.00mm); Digikey: https://www.digikey.com/product-detail/en/samtec-inc/TMMH-108-01-T-T/SAM12190-ND/6692344; Drawing: http://suddendocs.samtec.com/prints/tmmh-1xx-xx-xx-x-xxx-mkt.pdf
P4-P7 = Header 4: Header, 4-Pin; LatestRevisionDate: 17-Jul-2002; LatestRevisionNote: Re-released for DXP Platform.; Publisher: Altium Limited
  P5 P7: Digikey: https://www.digikey.com/product-detail/en/DF13-4P-1.25DSA/H2193-ND/241767
R27-R30 = Res3: Resistor; Published: 8-Jun-2000; LatestRevisionDate: 29-May-2009; LatestRevisionNote: IPC-7351 Footprint Added.; PackageReference: J1-0603; Publisher: Altium Limited; PackageDescription: Chip Resistor

## Sheet Embedded_Chip.SchDoc
size A; SheetNumber: 4; SheetTotal: 9
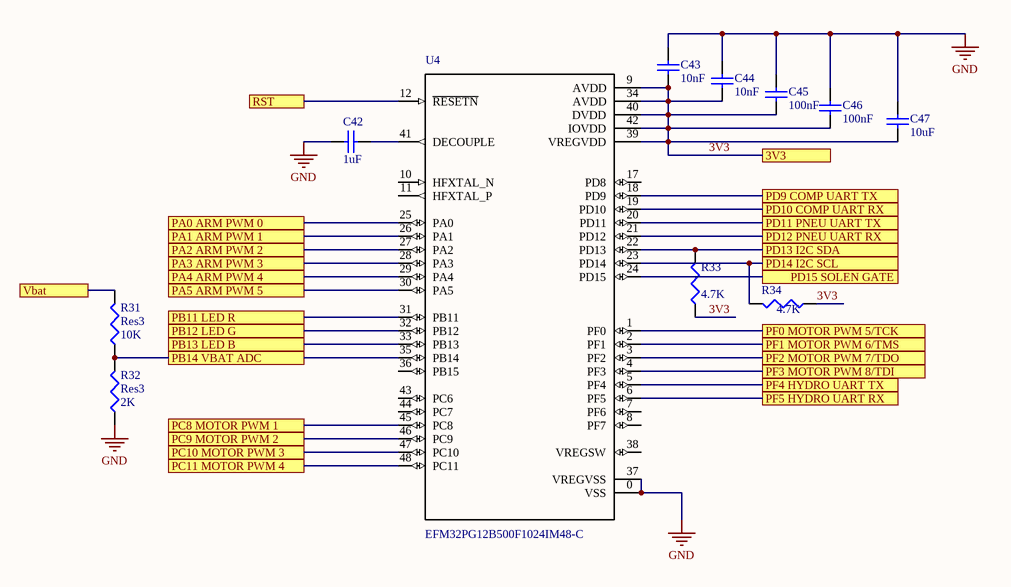
[diagram p6: Embedded_Chip.SchDoc]

### Parts
(Parts that share a designator on the sheet are numbered #1, #2 ... from top to bottom, then left to right.)
C42  value 1uF  [C1206]  (hidden comment: Cap Semi)
C43  value 10nF  [C1206]  (hidden comment: Cap Semi)
C44  value 10nF  [C1206]  (hidden comment: Cap Semi)
C45  value 100nF  [C1206]  (hidden comment: Cap Semi)
C46  value 100nF  [C1206]  (hidden comment: Cap Semi)
C47  value 10uF  [C1206]  (hidden comment: Cap Semi)
R31  Res3  value 10K  [J1-0603]
R32  Res3  value 2K  [J1-0603]
R33  value 4.7K  [J1-0603]  (hidden comment: Res3)
R34  value 4.7K  [J1-0603]  (hidden comment: Res3)
U4#2  EFM32PG12B500F1024IM48-C  [QFN50P700X700X90-49N]

### Ports
3V3, PA0 ARM PWM 0, PA1 ARM PWM 1, PA2 ARM PWM 2, PA3 ARM PWM 3, PA4 ARM PWM 4, PA5 ARM PWM 5, PB11 LED R, PB12 LED G, PB13 LED B, PB14 VBAT ADC, PC8 MOTOR PWM 1, PC9 MOTOR PWM 2, PC10 MOTOR PWM 3, PC11 MOTOR PWM 4, PD9 COMP UART TX, PD10 COMP UART RX, PD11 PNEU UART TX, PD12 PNEU UART RX, PD13 I2C SDA, PD14 I2C SCL, PD15 SOLEN GATE, PF0 MOTOR PWM 5/TCK, PF1 MOTOR PWM 6/TMS, PF2 MOTOR PWM 7/TDO, PF3 MOTOR PWM 8/TDI, PF4 HYDRO UART TX, PF5 HYDRO UART RX, RST, Vbat

### Nets
GND: C42.2 C43.1 C44.1 C45.1 C46.1 C47.1 R32.1 U4#2.0(VSS) U4#2.37(VREGVSS)
3V3: C43.2 C44.2 C45.2 C46.2 C47.2 R33.1 R34.1 U4#2.9(AVDD) U4#2.34(AVDD) U4#2.39(VREGVDD) U4#2.40(DVDD) U4#2.42(IOVDD) ; port 3V3
PA0 ARM PWM 0: U4#2.25(PA0) ; port PA0 ARM PWM 0
PA1 ARM PWM 1: U4#2.26(PA1) ; port PA1 ARM PWM 1
PA2 ARM PWM 2: U4#2.27(PA2) ; port PA2 ARM PWM 2
PA3 ARM PWM 3: U4#2.28(PA3) ; port PA3 ARM PWM 3
PA4 ARM PWM 4: U4#2.29(PA4) ; port PA4 ARM PWM 4
PA5 ARM PWM 5: U4#2.30(PA5) ; port PA5 ARM PWM 5
PB11 LED R: U4#2.31(PB11) ; port PB11 LED R
PB12 LED G: U4#2.32(PB12) ; port PB12 LED G
PB13 LED B: U4#2.33(PB13) ; port PB13 LED B
PC8 MOTOR PWM 1: U4#2.45(PC8) ; port PC8 MOTOR PWM 1
PC9 MOTOR PWM 2: U4#2.46(PC9) ; port PC9 MOTOR PWM 2
PC10 MOTOR PWM 3: U4#2.47(PC10) ; port PC10 MOTOR PWM 3
PC11 MOTOR PWM 4: U4#2.48(PC11) ; port PC11 MOTOR PWM 4
PD11 PNEU UART TX: U4#2.20(PD11) ; port PD11 PNEU UART TX
PD12 PNEU UART RX: U4#2.21(PD12) ; port PD12 PNEU UART RX
PD13 I2C SDA: R33.2 U4#2.22(PD13) ; port PD13 I2C SDA
PD14 I2C SCL: R34.2 U4#2.23(PD14) ; port PD14 I2C SCL
PF0 MOTOR PWM 5/TCK: U4#2.1(PF0) ; port PF0 MOTOR PWM 5/TCK
PF1 MOTOR PWM 6/TMS: U4#2.2(PF1) ; port PF1 MOTOR PWM 6/TMS
PF2 MOTOR PWM 7/TDO: U4#2.3(PF2) ; port PF2 MOTOR PWM 7/TDO
PF3 MOTOR PWM 8/TDI: U4#2.4(PF3) ; port PF3 MOTOR PWM 8/TDI
PF4 HYDRO UART TX: U4#2.5(PF4) ; port PF4 HYDRO UART TX
PF5 HYDRO UART RX: U4#2.6(PF5) ; port PF5 HYDRO UART RX
RST: U4#2.12(~{RESETN}) ; port RST
Vbat: R31.2 ; port Vbat
NetC42_1: C42.1 U4#2.41(DECOUPLE)
NetR31_1: R31.1 R32.2 U4#2.35(PB14) ; port PB14 VBAT ADC
NetR38_1: U4#2.24(PD15) ; port PD15 SOLEN GATE
NetU4#2_18: U4#2.18(PD9) ; port PD9 COMP UART TX
NetU4#2_19: U4#2.19(PD10) ; port PD10 COMP UART RX

Not connected (* = marked no-connect by the designer): U4#2 7(PF6) 8(PF7) 10(HFXTAL_N) 11(HFXTAL_P) 17(PD8) 36(PB15) 38(VREGSW) 43(PC6) 44(PC7)

### Library data of the parts
C42-C47 = Cap Semi: Capacitor (Semiconductor SIM Model); Published: 8-Jun-2000; LatestRevisionDate: 29-May-2009; LatestRevisionNote: IPC-7351 Footprint Added.; PackageReference: C1206; Publisher: Altium Limited; PackageDescription: Chip Capacitor
R31-R34 = Res3: Resistor; Published: 8-Jun-2000; LatestRevisionDate: 29-May-2009; LatestRevisionNote: IPC-7351 Footprint Added.; PackageReference: J1-0603; Publisher: Altium Limited; PackageDescription: Chip Resistor
U4#2 = EFM32PG12B500F1024IM48-C: ARM® Cortex®-M4 Pearl Gecko Microcontroller IC 32-Bit 40MHz 1MB (1M x 8) FLASH 48-QFN (7x7); MP: EFM32PG12B500F1024GM48-B; MF: Silicon Labs; Package: QFN-48 Silicon Labs; Price: None; Availability: Unavailable; SnapEDA_Link: https://www.snapeda.com/parts/EFM32PG12B500F1024GM48-B/Silicon%20Labs/view-part/?ref=snap; Value: *; ComponentLink1Description: Digi-Key; ComponentLink1URL: https://www.digikey.com/product-detail/en/silicon-labs/EFM32PG12B500F1024IM48-C/336-5333-ND/8161157

## Sheet Embedded_Circuits.SchDoc
size A; SheetNumber: 3; SheetTotal: 9
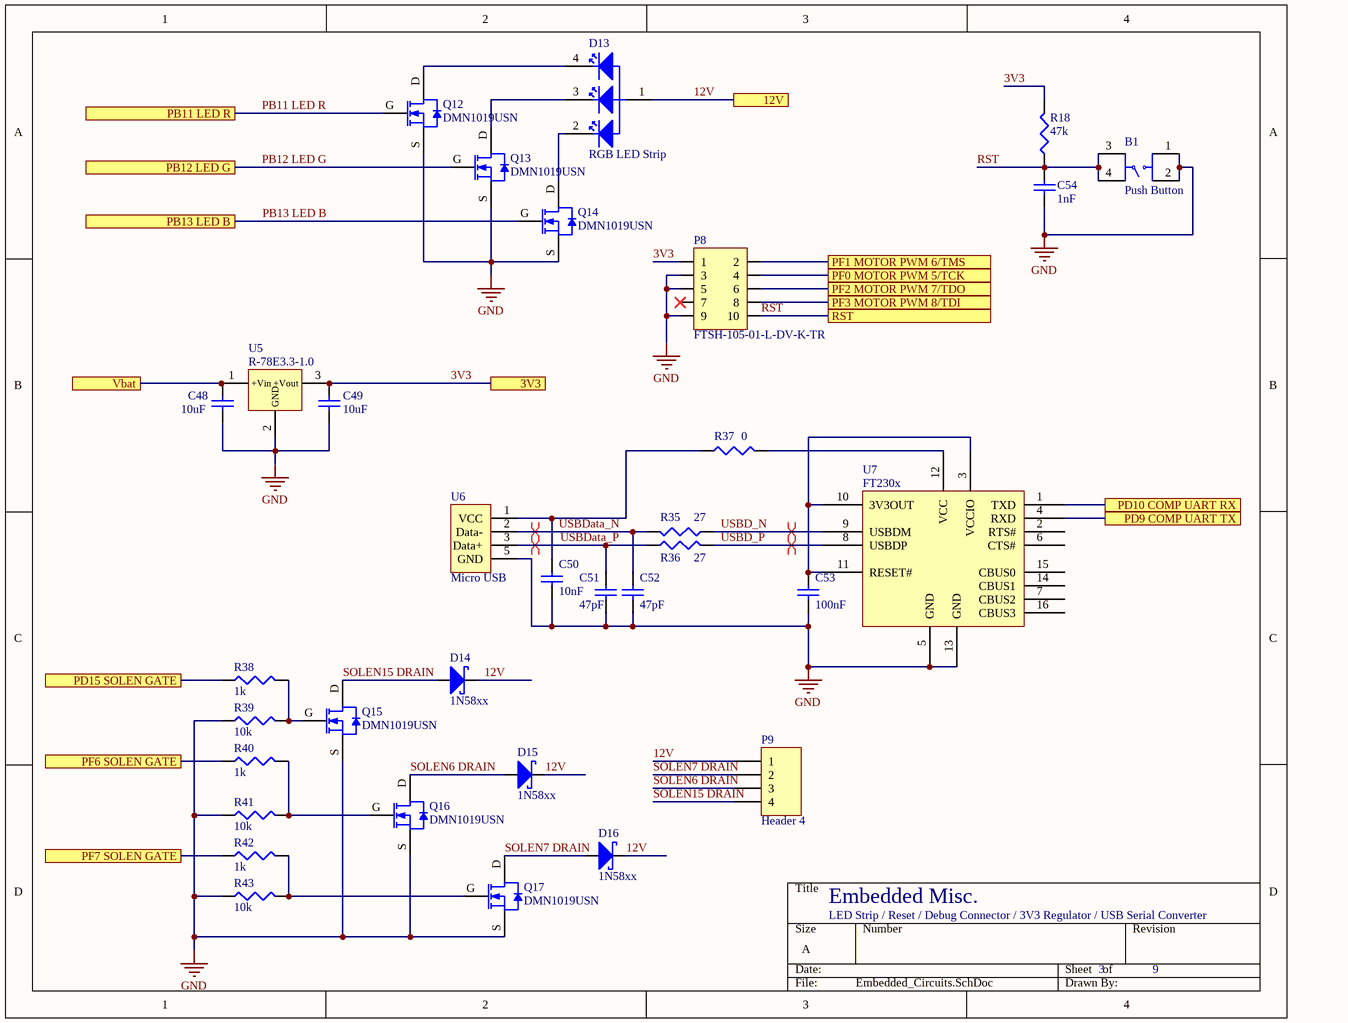
[diagram p7: Embedded_Circuits.SchDoc]

### Parts
(Parts that share a designator on the sheet are numbered #1, #2 ... from top to bottom, then left to right.)
B1  Push Button  [Push Button]
C48  value 10uF  [C1206]  (hidden comment: Cap)
C49  value 10uF  [C1206]  (hidden comment: Cap)
C50  value 10nF  [C1206]  (hidden comment: Cap)
C51  value 47pF  [C1206]  (hidden comment: Cap)
C52  value 47pF  [C1206]  (hidden comment: Cap)
C53  value 100nF  [C1206]  (hidden comment: Cap)
C54  value 1nF  [C1206]  (hidden comment: Cap Semi)
D13  RGB LED Strip  [Header 1x4]
D14  1N58xx  [1N58xx]
D15  1N58xx  [1N58xx]
D16  1N58xx  [1N58xx]
P8  FTSH-105-01-L-DV-K-TR  [FTSH-105-01-L-DV-K-TR]
P9  Header 4  [Header 1x4]
Q12  DMN1019USN  [SOT-23]
Q13  DMN1019USN  [SOT-23]
Q14  DMN1019USN  [SOT-23]
Q15  DMN1019USN  [SOT-23]
Q16  DMN1019USN  [SOT-23]
Q17  DMN1019USN  [SOT-23]
R18#2  value 47k  [J1-0603]  (hidden comment: Res3)
R35  value 27  [J1-0603]  (hidden comment: Res3)
R36  value 27  [J1-0603]  (hidden comment: Res3)
R37  value 0  [J1-0603]  (hidden comment: Res3)
R38  value 1k  [J1-0603]  (hidden comment: Res3)
R39  value 10k  [J1-0603]  (hidden comment: Res3)
R40  value 1k  [J1-0603]  (hidden comment: Res3)
R41  value 10k  [J1-0603]  (hidden comment: Res3)
R42  value 1k  [J1-0603]  (hidden comment: Res3)
R43  value 10k  [J1-0603]  (hidden comment: Res3)
U5  R-78E3.3-1.0  [R-78Exx-1.0]
U6  Micro USB  [Micro USB]
U7  FT230x  [FT230X]

### Ports
3V3, 12V, PB11 LED R, PB12 LED G, PB13 LED B, PD9 COMP UART TX, PD10 COMP UART RX, PD15 SOLEN GATE, PF0 MOTOR PWM 5/TCK, PF1 MOTOR PWM 6/TMS, PF2 MOTOR PWM 7/TDO, PF3 MOTOR PWM 8/TDI, PF6 SOLEN GATE, PF7 SOLEN GATE, RST, Vbat

### Nets
GND: B1.1 B1.2 C48.1 C49.1 C50.1 C51.1 C52.1 C53.1 C54.1 P8.3 P8.5 P8.9 Q12.S Q13.S Q14.S Q15.S Q16.S Q17.S R39.1 R41.1 R43.1 U5.2(GND) U6.5(GND) U7.5(GND) U7.13(GND)
3V3: C49.2 P8.1 R18#2.2 U5.3(+Vout) ; port 3V3
12V: D13.1 D14.K(Cathode) D15.K(Cathode) D16.K(Cathode) P9.1 ; port 12V
PB11 LED R: Q12.G ; port PB11 LED R
PB12 LED G: Q13.G ; port PB12 LED G
PB13 LED B: Q14.G ; port PB13 LED B
PF0 MOTOR PWM 5/TCK: P8.4 ; port PF0 MOTOR PWM 5/TCK
PF1 MOTOR PWM 6/TMS: P8.2 ; port PF1 MOTOR PWM 6/TMS
PF2 MOTOR PWM 7/TDO: P8.6 ; port PF2 MOTOR PWM 7/TDO
PF3 MOTOR PWM 8/TDI: P8.8 ; port PF3 MOTOR PWM 8/TDI
RST: B1.3 B1.4 C54.2 P8.10 R18#2.1 ; port RST
SOLEN6 DRAIN: D15.A(Anode) P9.3 Q16.D
SOLEN7 DRAIN: D16.A(Anode) P9.2 Q17.D
SOLEN15 DRAIN: D14.A(Anode) P9.4 Q15.D
USBD_N: R35.1 U7.9(USBDM)
USBD_P: R36.2 U7.8(USBDP)
USBData_N: C52.2 R35.2 U6.2(Data-)
USBData_P: C51.2 R36.1 U6.3(Data+)
Vbat: C48.2 U5.1(+Vin) ; port Vbat
NetC50_2: C50.2 R37.1 U6.1(VCC)
NetC53_2: C53.2 U7.3(VCCIO) U7.10(3V3OUT) U7.11(RESET#)
NetD13_2: D13.2 Q14.D
NetD13_3: D13.3 Q13.D
NetD13_4: D13.4 Q12.D
NetQ15_G: Q15.G R38.2 R39.2
NetQ16_G: Q16.G R40.2 R41.2
NetQ17_G: Q17.G R42.2 R43.2
NetR37_2: R37.2 U7.12(VCC)
NetR38_1: R38.1 ; port PD15 SOLEN GATE
NetR40_1: R40.1 ; port PF6 SOLEN GATE
NetR42_1: R42.1 ; port PF7 SOLEN GATE
NetU4#2_18: U7.4(RXD) ; port PD9 COMP UART TX
NetU4#2_19: U7.1(TXD) ; port PD10 COMP UART RX

Not connected (* = marked no-connect by the designer): P8 7*; U7 2(RTS#) 6(CTS#) 7(CBUS2) 14(CBUS1) 15(CBUS0) 16(CBUS3)

### Layout directives
differential pair: USBD_N, USBD_P, USBData_N, USBData_P

### Notes on the sheet
- Embedded Misc.
- LED Strip / Reset / Debug Connector / 3V3 Regulator / USB Serial Converter

### Library data of the parts
B1 = Push Button: Tactile Switch SPST-NO Top Actuated Through Hole; Digikey Link: https://www.digikey.com/product-detail/en/te-connectivity-alcoswitch-switches/FSM101/450-1157-ND/701084; Drawing: https://www.te.com/commerce/DocumentDelivery/DDEController?Action=srchrtrv&DocNm=1571140&DocType=Customer+Drawing&DocLang=English
C48-C53 = Cap: Capacitor; Published: 8-Jun-2000; LatestRevisionDate: 17-Jul-2002; LatestRevisionNote: Re-released for DXP Platform.; PackageReference: RAD-0.3; Publisher: Altium Limited; PackageDescription: Radial Cap, Thru-Hole; 2 Leads; 0.3 in Pin Spacing; Supplier 1: Digi-Key
  C48 C49: Supplier Part Number 1: 1276-2872-1-ND
  C50: Supplier Part Number 1: 1276-1921-1-ND
  C51 C52: Supplier Part Number 1: 490-16375-1-ND
  C53: Supplier Part Number 1: 1276-1001-1-ND
C54 = Cap Semi: Capacitor (Semiconductor SIM Model); Published: 8-Jun-2000; LatestRevisionDate: 29-May-2009; LatestRevisionNote: IPC-7351 Footprint Added.; PackageReference: C1206; Publisher: Altium Limited; PackageDescription: Chip Capacitor; Supplier 1: Digi-Key; Supplier Part Number 1: 490-4761-1-ND
D13 = RGB LED Strip: LED RGB Strip - Bare Nonaddressable; Sparkfun Link: https://www.sparkfun.com/products/12021
D14-D16 = 1N58xx: 1A Schottky Barrier Rectifier Diode; Datasheet: http://www.kesenes.com/pdf/1n5817-1n5819.pdf; Digikey: https://www.digikey.com/product-detail/en/comchip-technology/SS24-HF/641-SS24-HFCT-ND/10443817
P8 = JTAG Header: CONN HEADER 10POS DUAL .05" SMD; Digikey Link: https://www.digikey.com/product-detail/en/samtec-inc/FTSH-105-01-L-DV-K-TR/SAM13165CT-ND/8827920; Drawings: http://suddendocs.samtec.com/prints/ftsh-1xx-xx-xxx-dv-xxx-xxx-mkt.pdf; Datasheet: http://suddendocs.samtec.com/catalog_english/ftsh_smt.pdf
P9 = Header 4: Header, 4-Pin; LatestRevisionDate: 17-Jul-2002; LatestRevisionNote: Re-released for DXP Platform.; Publisher: Altium Limited
Q12-Q17 = DMN1019USN: 12V N-Channel Enhancement Mode MOSFET; Datasheet: https://www.diodes.com/assets/Datasheets/DMN1019USN.pdf; Digikey: https://www.digikey.com/product-detail/en/diodes-incorporated/DMN1019USN-13/DMN1019USN-13DICT-ND/4898885
R18#2 R35-R43 = Res3: Resistor; Published: 8-Jun-2000; LatestRevisionDate: 29-May-2009; LatestRevisionNote: IPC-7351 Footprint Added.; PackageReference: J1-0603; Publisher: Altium Limited; PackageDescription: Chip Resistor
U5 = R-78Exx-1.0: 1A DC/DC Voltage Converter; Datasheet: https://www.recom-power.com/pdf/Innoline/R-78Exx-0.5.pdf
U6 = Micro USB: USB - micro B USB 2.0 Receptacle Connector 5 Position Surface Mount, Right Angle; Digikey: https://www.digikey.com/product-detail/en/molex-llc/1050170001/WM1399CT-ND/2350885; Datasheet: https://www.molex.com/pdm_docs/sd/1050170001_sd.pdf
U7 = FTDI FT230x: USB to Basic UART IC; Datasheet: https://www.ftdichip.com/Support/Documents/DataSheets/ICs/DS_FT230X.pdf

## Nets that join several sheets
GND: Power_Embedded_Board_Top (20 pins), 9V_Converter (C1.1 C2.1 U8.2), 12V_Converter (20 pins), 19V_Converter (21 pins), 48V_Converter (24 pins), Embedded_System_Top (20 pins), Embedded_Chip (9 pins), Embedded_Circuits (25 pins)
3V3: Embedded_System_Top (18 pins), Embedded_Chip (12 pins), Embedded_Circuits (C49.2 P8.1 R18#2.2 U5.3)
9V: Power_Embedded_Board_Top (J1.3 J1.4), 9V_Converter (C2.2 U8.3)
12V: Power_Embedded_Board_Top (J4.4 J5.3 J5.4), 12V_Converter (5 pins), Embedded_System_Top (P4.4), Embedded_Circuits (5 pins)
19V: Power_Embedded_Board_Top (J2.3 J2.4 J8.3 J8.4), 19V_Converter (R19.2 U4#1.8)
48V: Power_Embedded_Board_Top (J3.3 J3.4), 48V_Converter (13 pins)
NetR38_1: Embedded_Chip (U4#2.24), Embedded_Circuits (R38.1)
NetU4#2_18: Embedded_Chip (U4#2.18), Embedded_Circuits (U7.4)
NetU4#2_19: Embedded_Chip (U4#2.19), Embedded_Circuits (U7.1)
PA0 ARM PWM 0: Embedded_System_Top (P2.1), Embedded_Chip (U4#2.25)
PA1 ARM PWM 1: Embedded_System_Top (P2.4), Embedded_Chip (U4#2.26)
PA2 ARM PWM 2: Embedded_System_Top (P2.7), Embedded_Chip (U4#2.27)
PA3 ARM PWM 3: Embedded_System_Top (P2.10), Embedded_Chip (U4#2.28)
PA4 ARM PWM 4: Embedded_System_Top (P2.13), Embedded_Chip (U4#2.29)
PA5 ARM PWM 5: Embedded_System_Top (P2.16), Embedded_Chip (U4#2.30)
PB11 LED R: Embedded_Chip (U4#2.31), Embedded_Circuits (Q12.G)
PB12 LED G: Embedded_Chip (U4#2.32), Embedded_Circuits (Q13.G)
PB13 LED B: Embedded_Chip (U4#2.33), Embedded_Circuits (Q14.G)
PC8 MOTOR PWM 1: Embedded_System_Top (P3.1), Embedded_Chip (U4#2.45)
PC9 MOTOR PWM 2: Embedded_System_Top (P3.4), Embedded_Chip (U4#2.46)
PC10 MOTOR PWM 3: Embedded_System_Top (P3.7), Embedded_Chip (U4#2.47)
PC11 MOTOR PWM 4: Embedded_System_Top (P3.10), Embedded_Chip (U4#2.48)
PD11 PNEU UART TX: Embedded_System_Top (R27.1), Embedded_Chip (U4#2.20)
PD12 PNEU UART RX: Embedded_System_Top (R28.1), Embedded_Chip (U4#2.21)
PD13 I2C SDA: Embedded_System_Top (P5.2 P7.2), Embedded_Chip (R33.2 U4#2.22)
PD14 I2C SCL: Embedded_System_Top (P5.3 P7.3), Embedded_Chip (R34.2 U4#2.23)
PF0 MOTOR PWM 5/TCK: Embedded_System_Top (P3.13), Embedded_Chip (U4#2.1), Embedded_Circuits (P8.4)
PF1 MOTOR PWM 6/TMS: Embedded_System_Top (P3.16), Embedded_Chip (U4#2.2), Embedded_Circuits (P8.2)
PF2 MOTOR PWM 7/TDO: Embedded_System_Top (P3.19), Embedded_Chip (U4#2.3), Embedded_Circuits (P8.6)
PF3 MOTOR PWM 8/TDI: Embedded_System_Top (P3.22), Embedded_Chip (U4#2.4), Embedded_Circuits (P8.8)
PF4 HYDRO UART TX: Embedded_System_Top (R29.2), Embedded_Chip (U4#2.5)
PF5 HYDRO UART RX: Embedded_System_Top (R30.2), Embedded_Chip (U4#2.6)
RST: Embedded_Chip (U4#2.12), Embedded_Circuits (5 pins)
Vbat: Power_Embedded_Board_Top (8 pins), 9V_Converter (C1.2 U8.1), 12V_Converter (5 pins), 19V_Converter (5 pins), 48V_Converter (6 pins), Embedded_System_Top (P6.1), Embedded_Chip (R31.2), Embedded_Circuits (C48.2 U5.1)